# Altium project NFC-Reader.PrjPcb (part 1 of 11)
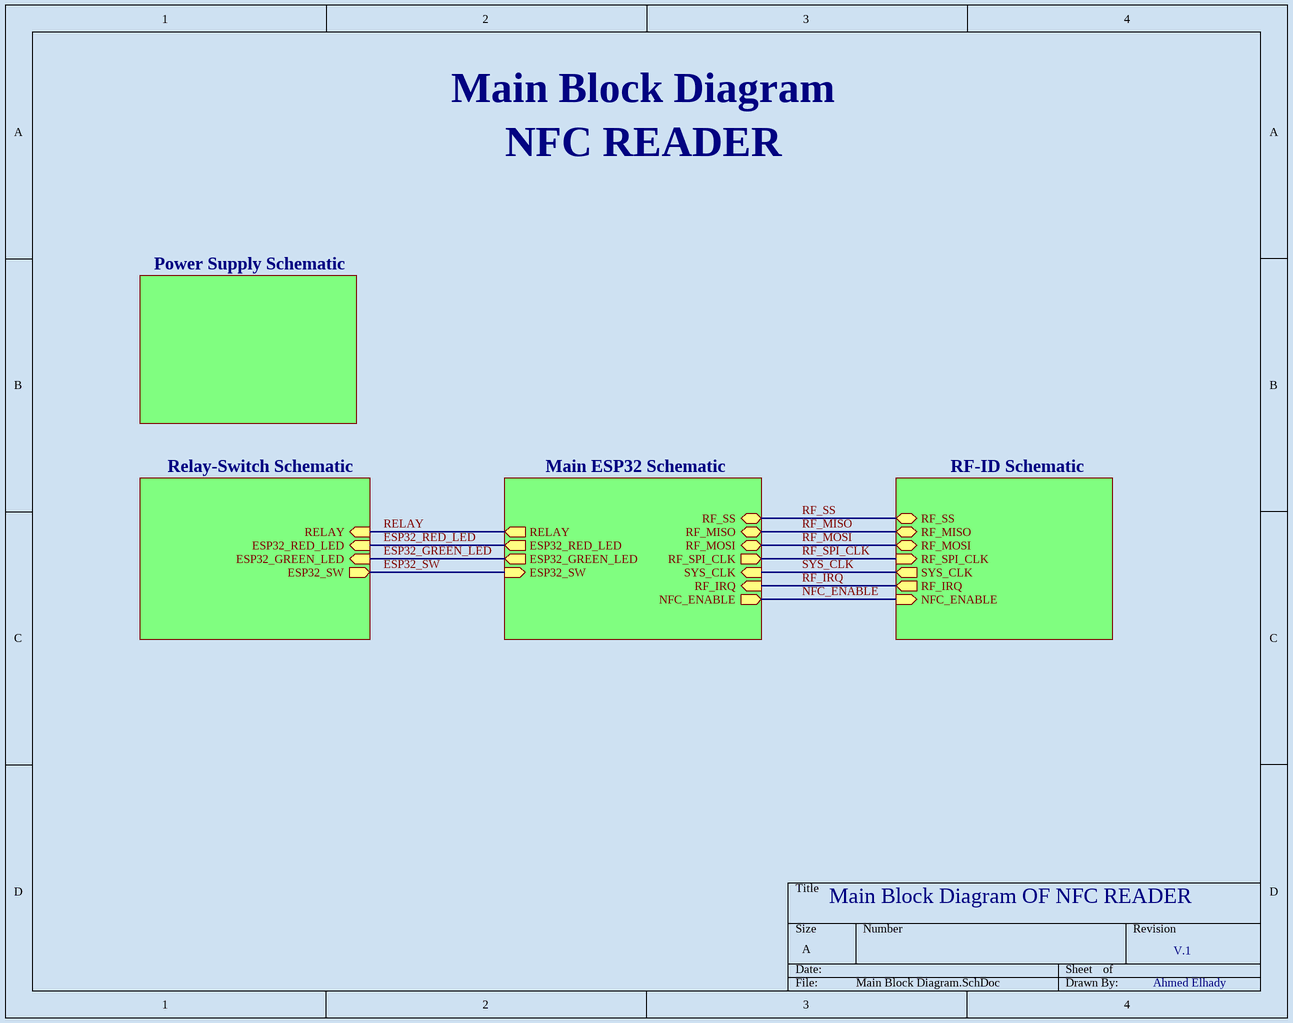
[diagram p0: Main Block Diagram.SchDoc]
5 sheets, 132 parts. Net scope: hierarchical (ports join the sheet entries above them; power ports are global).
Board file: NFC-Reader.PcbDoc
Sheets:
  Main Block Diagram.SchDoc
    Power Supply Schematic = Power Supply.SchDoc
    Main ESP32 Schematic = ESP32-Main.SchDoc
    RF-ID Schematic = RFID-Reader.SchDoc
    Relay-Switch Schematic = Relay-Switch.SchDoc

## Sheet Main Block Diagram.SchDoc
size A; SheetNumber: 1; SheetTotal: 5

### Sub-sheets
Main ESP32 Schematic = ESP32-Main.SchDoc: RF_SS (bidir), RF_MISO (bidir), RF_MOSI (bidir), RF_SPI_CLK (out), SYS_CLK (in), RF_IRQ (in), NFC_ENABLE (out), RELAY (out), ESP32_RED_LED (out), ESP32_GREEN_LED (out), ESP32_SW (in)
Power Supply Schematic = Power Supply.SchDoc: no entries
Relay-Switch Schematic = Relay-Switch.SchDoc: RELAY (in), ESP32_RED_LED (in), ESP32_GREEN_LED (in), ESP32_SW (out)
RF-ID Schematic = RFID-Reader.SchDoc: RF_SS (bidir), RF_MISO (bidir), RF_MOSI (bidir), RF_SPI_CLK (in), SYS_CLK (out), RF_IRQ (out), NFC_ENABLE (in)

### Nets
ESP32_GREEN_LED: sheet Main ESP32 Schematic/ESP32_GREEN_LED, sheet Relay-Switch Schematic/ESP32_GREEN_LED
ESP32_RED_LED: sheet Main ESP32 Schematic/ESP32_RED_LED, sheet Relay-Switch Schematic/ESP32_RED_LED
ESP32_SW: sheet Main ESP32 Schematic/ESP32_SW, sheet Relay-Switch Schematic/ESP32_SW
NFC_ENABLE: sheet Main ESP32 Schematic/NFC_ENABLE, sheet RF-ID Schematic/NFC_ENABLE
RELAY: sheet Main ESP32 Schematic/RELAY, sheet Relay-Switch Schematic/RELAY
RF_IRQ: sheet Main ESP32 Schematic/RF_IRQ, sheet RF-ID Schematic/RF_IRQ
RF_MISO: sheet Main ESP32 Schematic/RF_MISO, sheet RF-ID Schematic/RF_MISO
RF_MOSI: sheet Main ESP32 Schematic/RF_MOSI, sheet RF-ID Schematic/RF_MOSI
RF_SPI_CLK: sheet Main ESP32 Schematic/RF_SPI_CLK, sheet RF-ID Schematic/RF_SPI_CLK
RF_SS: sheet Main ESP32 Schematic/RF_SS, sheet RF-ID Schematic/RF_SS
SYS_CLK: sheet Main ESP32 Schematic/SYS_CLK, sheet RF-ID Schematic/SYS_CLK

### Notes on the sheet
- Main Block Diagram
- NFC READER
- Main Block Diagram OF NFC READER
- V.1
- Ahmed Elhady

## Sheet Power Supply.SchDoc
size A3; SheetNumber: 2; SheetTotal: 5
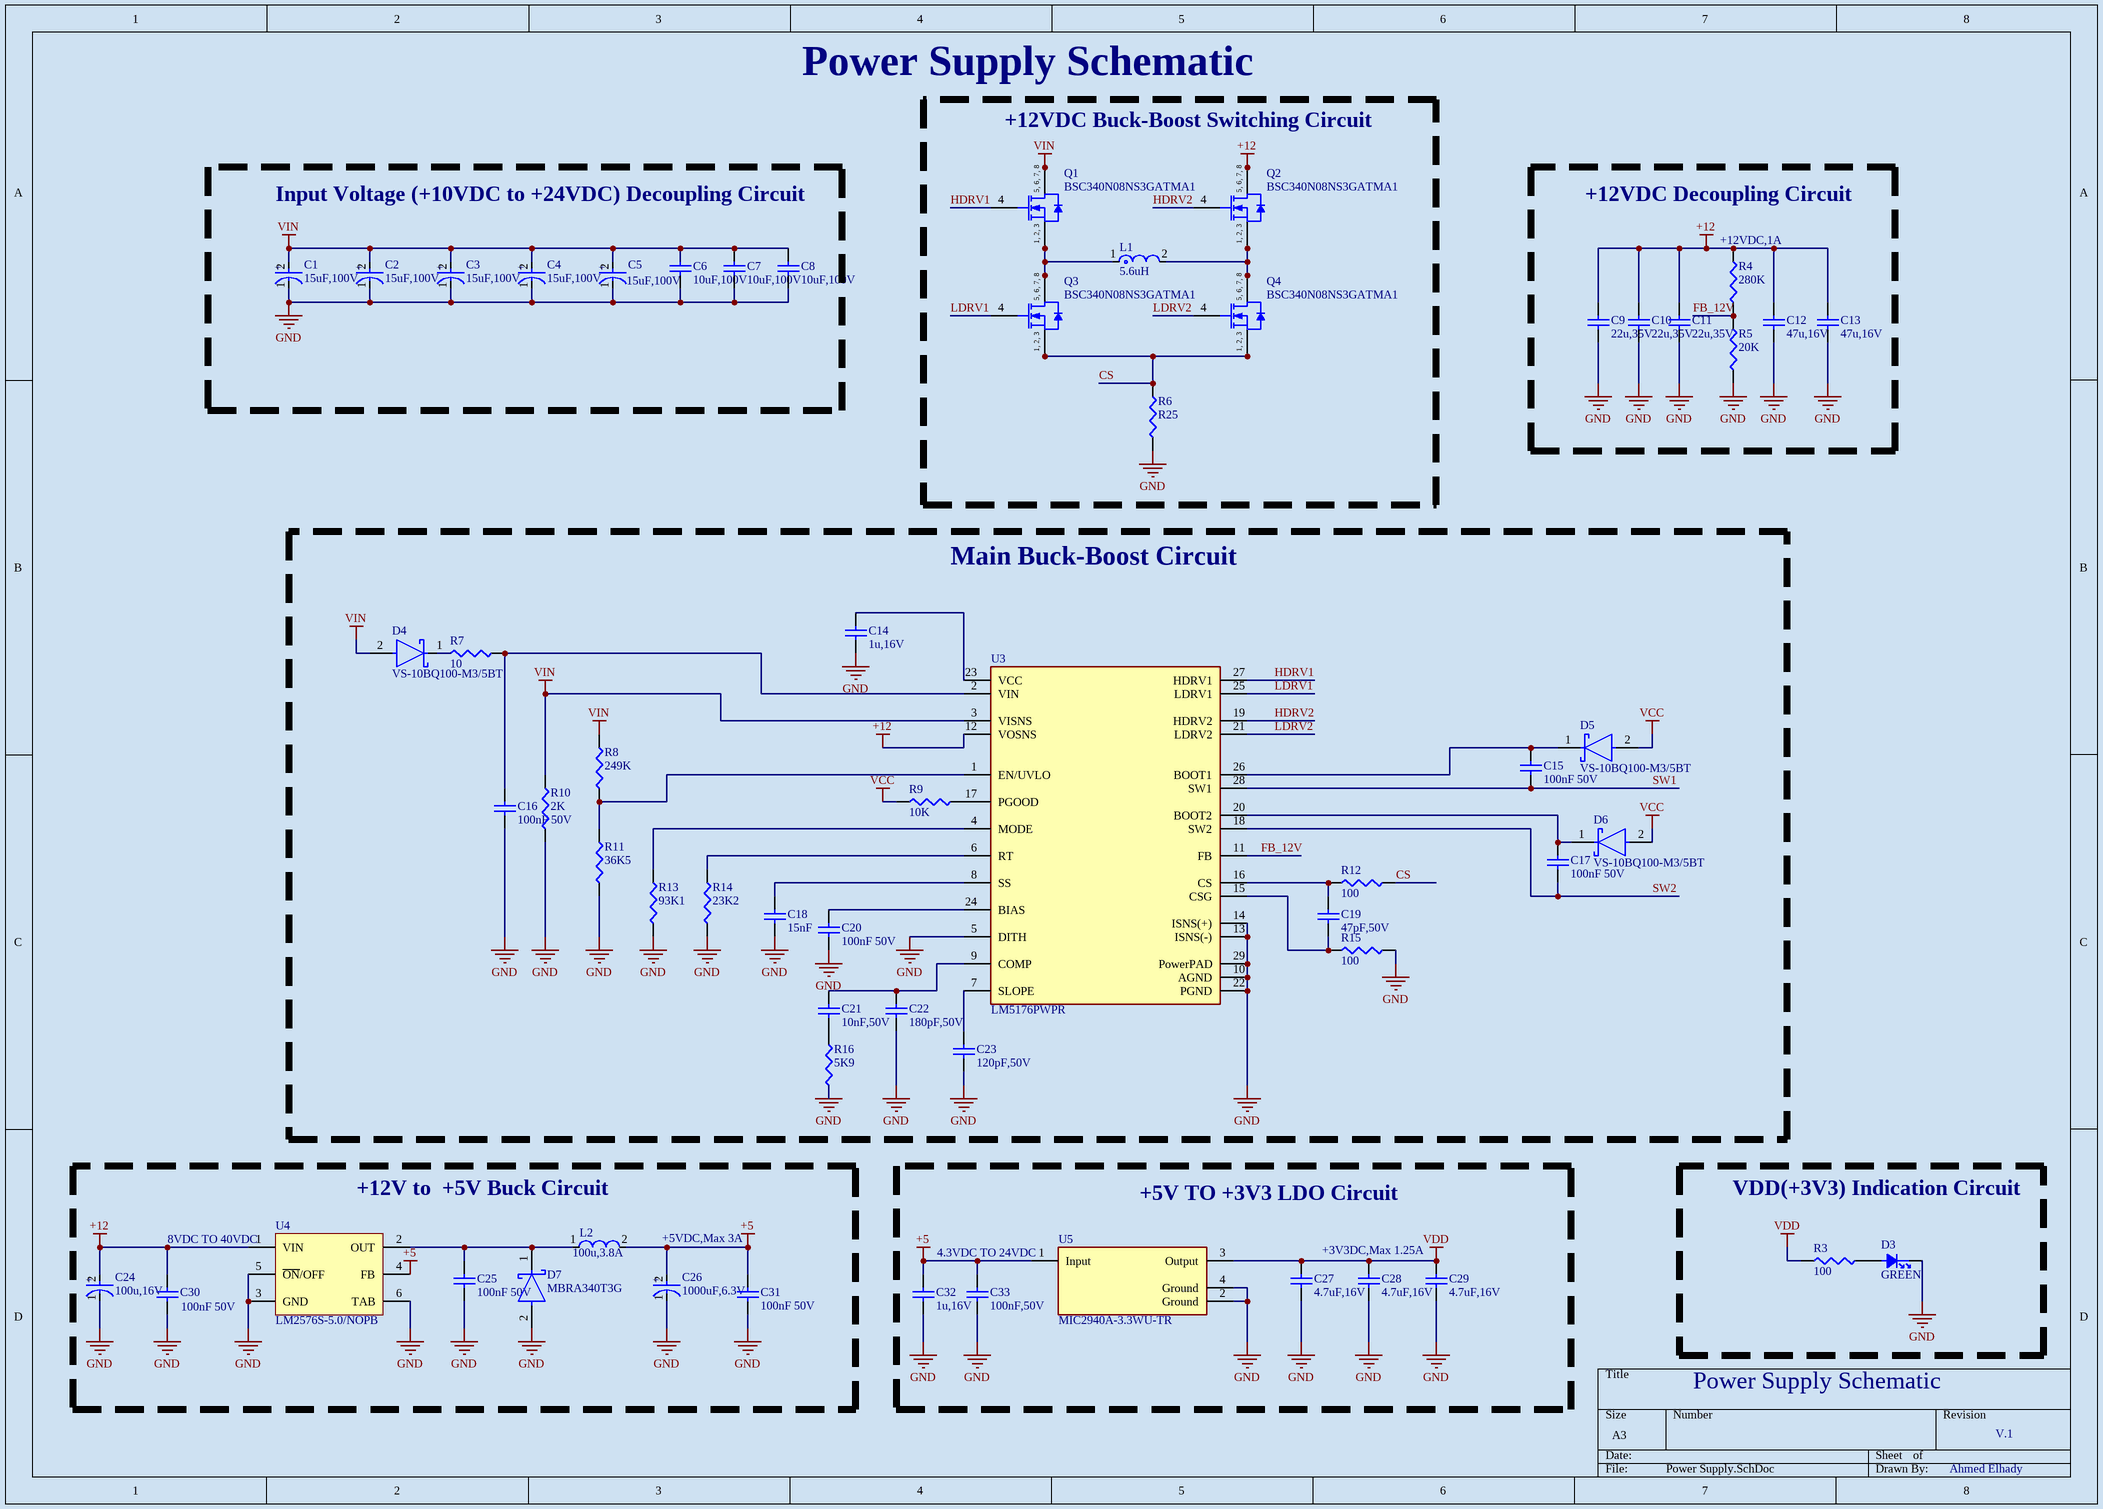
[diagram p1: Power Supply.SchDoc]

### Parts
C1  15uF,100V  [FP-SMT-CAP-15U-100V-ELECTROLTIC]
C2  15uF,100V  [FP-SMT-CAP-15U-100V-ELECTROLTIC]
C3  15uF,100V  [FP-SMT-CAP-15U-100V-ELECTROLTIC]
C4  15uF,100V  [FP-SMT-CAP-15U-100V-ELECTROLTIC]
C5  15uF,100V  [FP-SMT-CAP-15U-100V-ELECTROLTIC]
C6  10uF,100V  [CAP-1210-10U-100V]
C7  10uF,100V  [CAP-1210-10U-100V]
C8  10uF,100V  [CAP-1210-10U-100V]
C9  22u,35V  [TDK_0805-22uF-35V]
C10  22u,35V  [TDK_0805-22uF-35V]
C11  22u,35V  [TDK_0805-22uF-35V]
C12  47u,16V  [cap1210-47u-16v]
C13  47u,16V  [cap1210-47u-16v]
C14  1u,16V  [0603 (1608 Metric)-CAP-100NF-50V]
C15  100nF 50V  [0603 (1608 Metric)-CAP-100NF-50V]
C16  100nF 50V  [0603 (1608 Metric)-CAP-100NF-50V]
C17  100nF 50V  [0603 (1608 Metric)-CAP-100NF-50V]
C18  15nF  [0603-Cap-15nf-25v]
C19  47pF,50V  [CAP-0603-47PF-50V]
C20  100nF 50V  [0603 (1608 Metric)-CAP-100NF-50V]
C21  10nF,50V  [CAPC1005X90N]
C22  180pF,50V  [C0805C-180pF-50V]
C23  120pF,50V  [FP-0603-120PF-50V]
C24  100u,16V  [CAP_EEEFP1C101AV]
C25  100nF 50V  [0603 (1608 Metric)-CAP-100NF-50V]
C26  1000uF,6.3V  [CAP_1000uF-SMT]
C27  4.7uF,16V  [CAPC1005X90N]
C28  4.7uF,16V  [CAPC1005X90N]
C29  4.7uF,16V  [CAPC1005X90N]
C30  100nF 50V  [0603 (1608 Metric)-CAP-100NF-50V]
C31  100nF 50V  [0603 (1608 Metric)-CAP-100NF-50V]
C32  1u,16V  [0603 (1608 Metric)-CAP-100NF-50V]
C33  100nF,50V  [0603 (1608 Metric)-CAP-100NF-50V]
D3  GREEN  [LED0402G]
D4  VS-10BQ100-M3/5BT  [Diode Schottky 100V 1A 2-Pin SMB T/R / DIODE SCHOTTK]
D5  VS-10BQ100-M3/5BT  [Diode Schottky 100V 1A 2-Pin SMB T/R / DIODE SCHOTTK]
D6  VS-10BQ100-M3/5BT  [Diode Schottky 100V 1A 2-Pin SMB T/R / DIODE SCHOTTK]
D7  MBRA340T3G  [Diode-SMD-Schotty-40V-3A]
L1  5.6uH  [Coilcraft_XAL5050_MFG]
L2  100u,3.8A  [COIL-SMD-100U-3.8A]
Q1  BSC340N08NS3GATMA1  [TDSON-8-MOSFET-N-CHANNEL]
Q2  BSC340N08NS3GATMA1  [TDSON-8-MOSFET-N-CHANNEL]
Q3  BSC340N08NS3GATMA1  [TDSON-8-MOSFET-N-CHANNEL]
Q4  BSC340N08NS3GATMA1  [TDSON-8-MOSFET-N-CHANNEL]
R3  100  [0603-RES-10OHM-0.1W]
R4  280K  [Vishay_CRCW0603-280k]
R5  20K  [20K-0603-Yageo_-_Phycomp_RC0603_0]
R6  R25  [RESC3015X65N-25mohm]
R7  10  [0603-RES-10OHM-0.1W]
R8  249K  [RESC1005X37N]
R9  10K  [YAGEO-0603-10K-0.1W]
R10  2K  [2K_0.125W_RESC2013X70X40NL20T20]
R11  36K5  [RESC1005X37N]
R12  100  [0603-RES-10OHM-0.1W]
R13  93K1  [RC0603_MFG-93.1k]
R14  23K2  [RESC1005X37N]
R15  100  [0603-RES-10OHM-0.1W]
R16  5K9  [RESC1005X37N]
U3  LM5176PWPR  [FP-TSSOP28-BUCK-BOOST-LM5176PWPR]
U4  LM2576S-5.0/NOPB  [DPAK-LM2576S-5.0/NOPB]
U5  MIC2940A-3.3WU-TR  [FP-TO263-3LD-REG-BUCK-3.3V]

### Blocks framed on the sheet
+12VDC Buck-Boost Switching Circuit: L1 Q1-Q4 R6
Input Voltage (+10VDC to +24VDC) Decoupling Circuit: C1-C8
+12VDC Decoupling Circuit: C9-C13 R4 R5
Main Buck-Boost Circuit: C14-C23 D4-D6 R7-R16 U3
+12V to  +5V Buck Circuit: C24-C26 C30 C31 D7 L2 U4
+5V TO +3V3 LDO Circuit: C27-C29 C32 C33 U5
VDD(+3V3) Indication Circuit: D3 R3

### Nets
+5: C26.2(ANODE) C31.2 C32.1 C33.2 L2.2 U4.4(FB) U5.1(Input)
+12: C9.2 C10.2 C11.2 C12.2 C13.2 C24.2(ANODE) C30.2 Q2.5(DRAIN) Q2.6(DRAIN) Q2.7(DRAIN) Q2.8(DRAIN) R4.2 U3.12(VOSNS) U4.1(VIN)
GND: C1.1(C) C2.1(C) C3.1(C) C4.1(C) C5.1(C) C6.1 C7.1 C8.1 C9.1 C10.1 C11.1 C12.1 C13.1 C14.1 C16.1 C18.1 C20.1 C22.1 C23.1 C24.1(CATHODE) C25.1 C26.1(CATHODE) C27.1 C28.1 C29.1 C30.1 C31.1 C32.2 C33.1 D3.1(Cathode) D7.2(A) R5.1 R6.1 R10.1 R11.1 R13.1 R14.1 R15.2 R16.2 U3.5(DITH) U3.10(AGND) U3.13(ISNS(-)) U3.14(ISNS(+)) U3.22(PGND) U3.29(PowerPAD) U4.3(GND) U4.5(~{ON}/OFF) U4.6(TAB) U5.2(Ground) U5.4(Ground)
VCC: D5.2(A) D6.2(A) R9.1
VDD: C27.2 C28.2 C29.2 R3.2 U5.3(Output)
VIN: C1.2(A) C2.2(A) C3.2(A) C4.2(A) C5.2(A) C6.2 C7.2 C8.2 D4.2(A) Q1.5(DRAIN) Q1.6(DRAIN) Q1.7(DRAIN) Q1.8(DRAIN) R8.2 R10.2 U3.3(VISNS)
CS: Q3.1(SOURCE) Q3.2(SOURCE) Q3.3(SOURCE) Q4.1(SOURCE) Q4.2(SOURCE) Q4.3(SOURCE) R6.2 R12.1
FB_12V: R4.1 R5.2 U3.11(FB)
HDRV1: Q1.4(GATE) U3.27(HDRV1)
HDRV2: Q2.4(GATE) U3.19(HDRV2)
LDRV1: Q3.4(GATE) U3.25(LDRV1)
LDRV2: Q4.4(GATE) U3.21(LDRV2)
SW1: C15.1 U3.28(SW1)
SW2: C17.1 U3.18(SW2)
NetC14_2: C14.2 U3.23(VCC)
NetC15_2: C15.2 D5.1(C) U3.26(BOOT1)
NetC16_2: C16.2 R7.1 U3.2(VIN)
NetC17_2: C17.2 D6.1(C) U3.20(BOOT2)
NetC18_2: C18.2 U3.8(SS)
NetC19_1: C19.1 R12.2 U3.16(CS)
NetC19_2: C19.2 R15.1 U3.15(CSG)
NetC20_2: C20.2 U3.24(BIAS)
NetC21_1: C21.1 R16.1
NetC21_2: C21.2 C22.2 U3.9(COMP)
NetC23_2: C23.2 U3.7(SLOPE)
NetC25_2: C25.2 D7.1(C) L2.1 U4.2(OUT)
NetD3_2: D3.2(Anode) R3.1
NetD4_1: D4.1(C) R7.2
NetL1_1: L1.1 Q1.1(SOURCE) Q1.2(SOURCE) Q1.3(SOURCE) Q3.5(DRAIN) Q3.6(DRAIN) Q3.7(DRAIN) Q3.8(DRAIN)
NetL1_2: L1.2 Q2.1(SOURCE) Q2.2(SOURCE) Q2.3(SOURCE) Q4.5(DRAIN) Q4.6(DRAIN) Q4.7(DRAIN) Q4.8(DRAIN)
NetR8_1: R8.1 R11.2 U3.1(EN/UVLO)
NetR9_2: R9.2 U3.17(PGOOD)
NetR13_2: R13.2 U3.4(MODE)
NetR14_2: R14.2 U3.6(RT)

### Notes on the sheet
- Power Supply Schematic
- (near R4) +12VDC,1A
- 8VDC TO 40VDC
- +5VDC,Max 3A
- 4.3VDC TO 24VDC
- +3V3DC,Max 1.25A
- V.1
- Ahmed Elhady
- (in symbol 100SXV15M) +
- (in symbol BSC340N08NS3GATMA1) 5, 6, 7, 8; 1, 2, 3
- (in symbol EEE-FP0J102AL) +
- (in symbol EEEFP1C101AV) +